# EasyEDA schematic SCH_AiOV4MicroCAN_2025-06-21.json
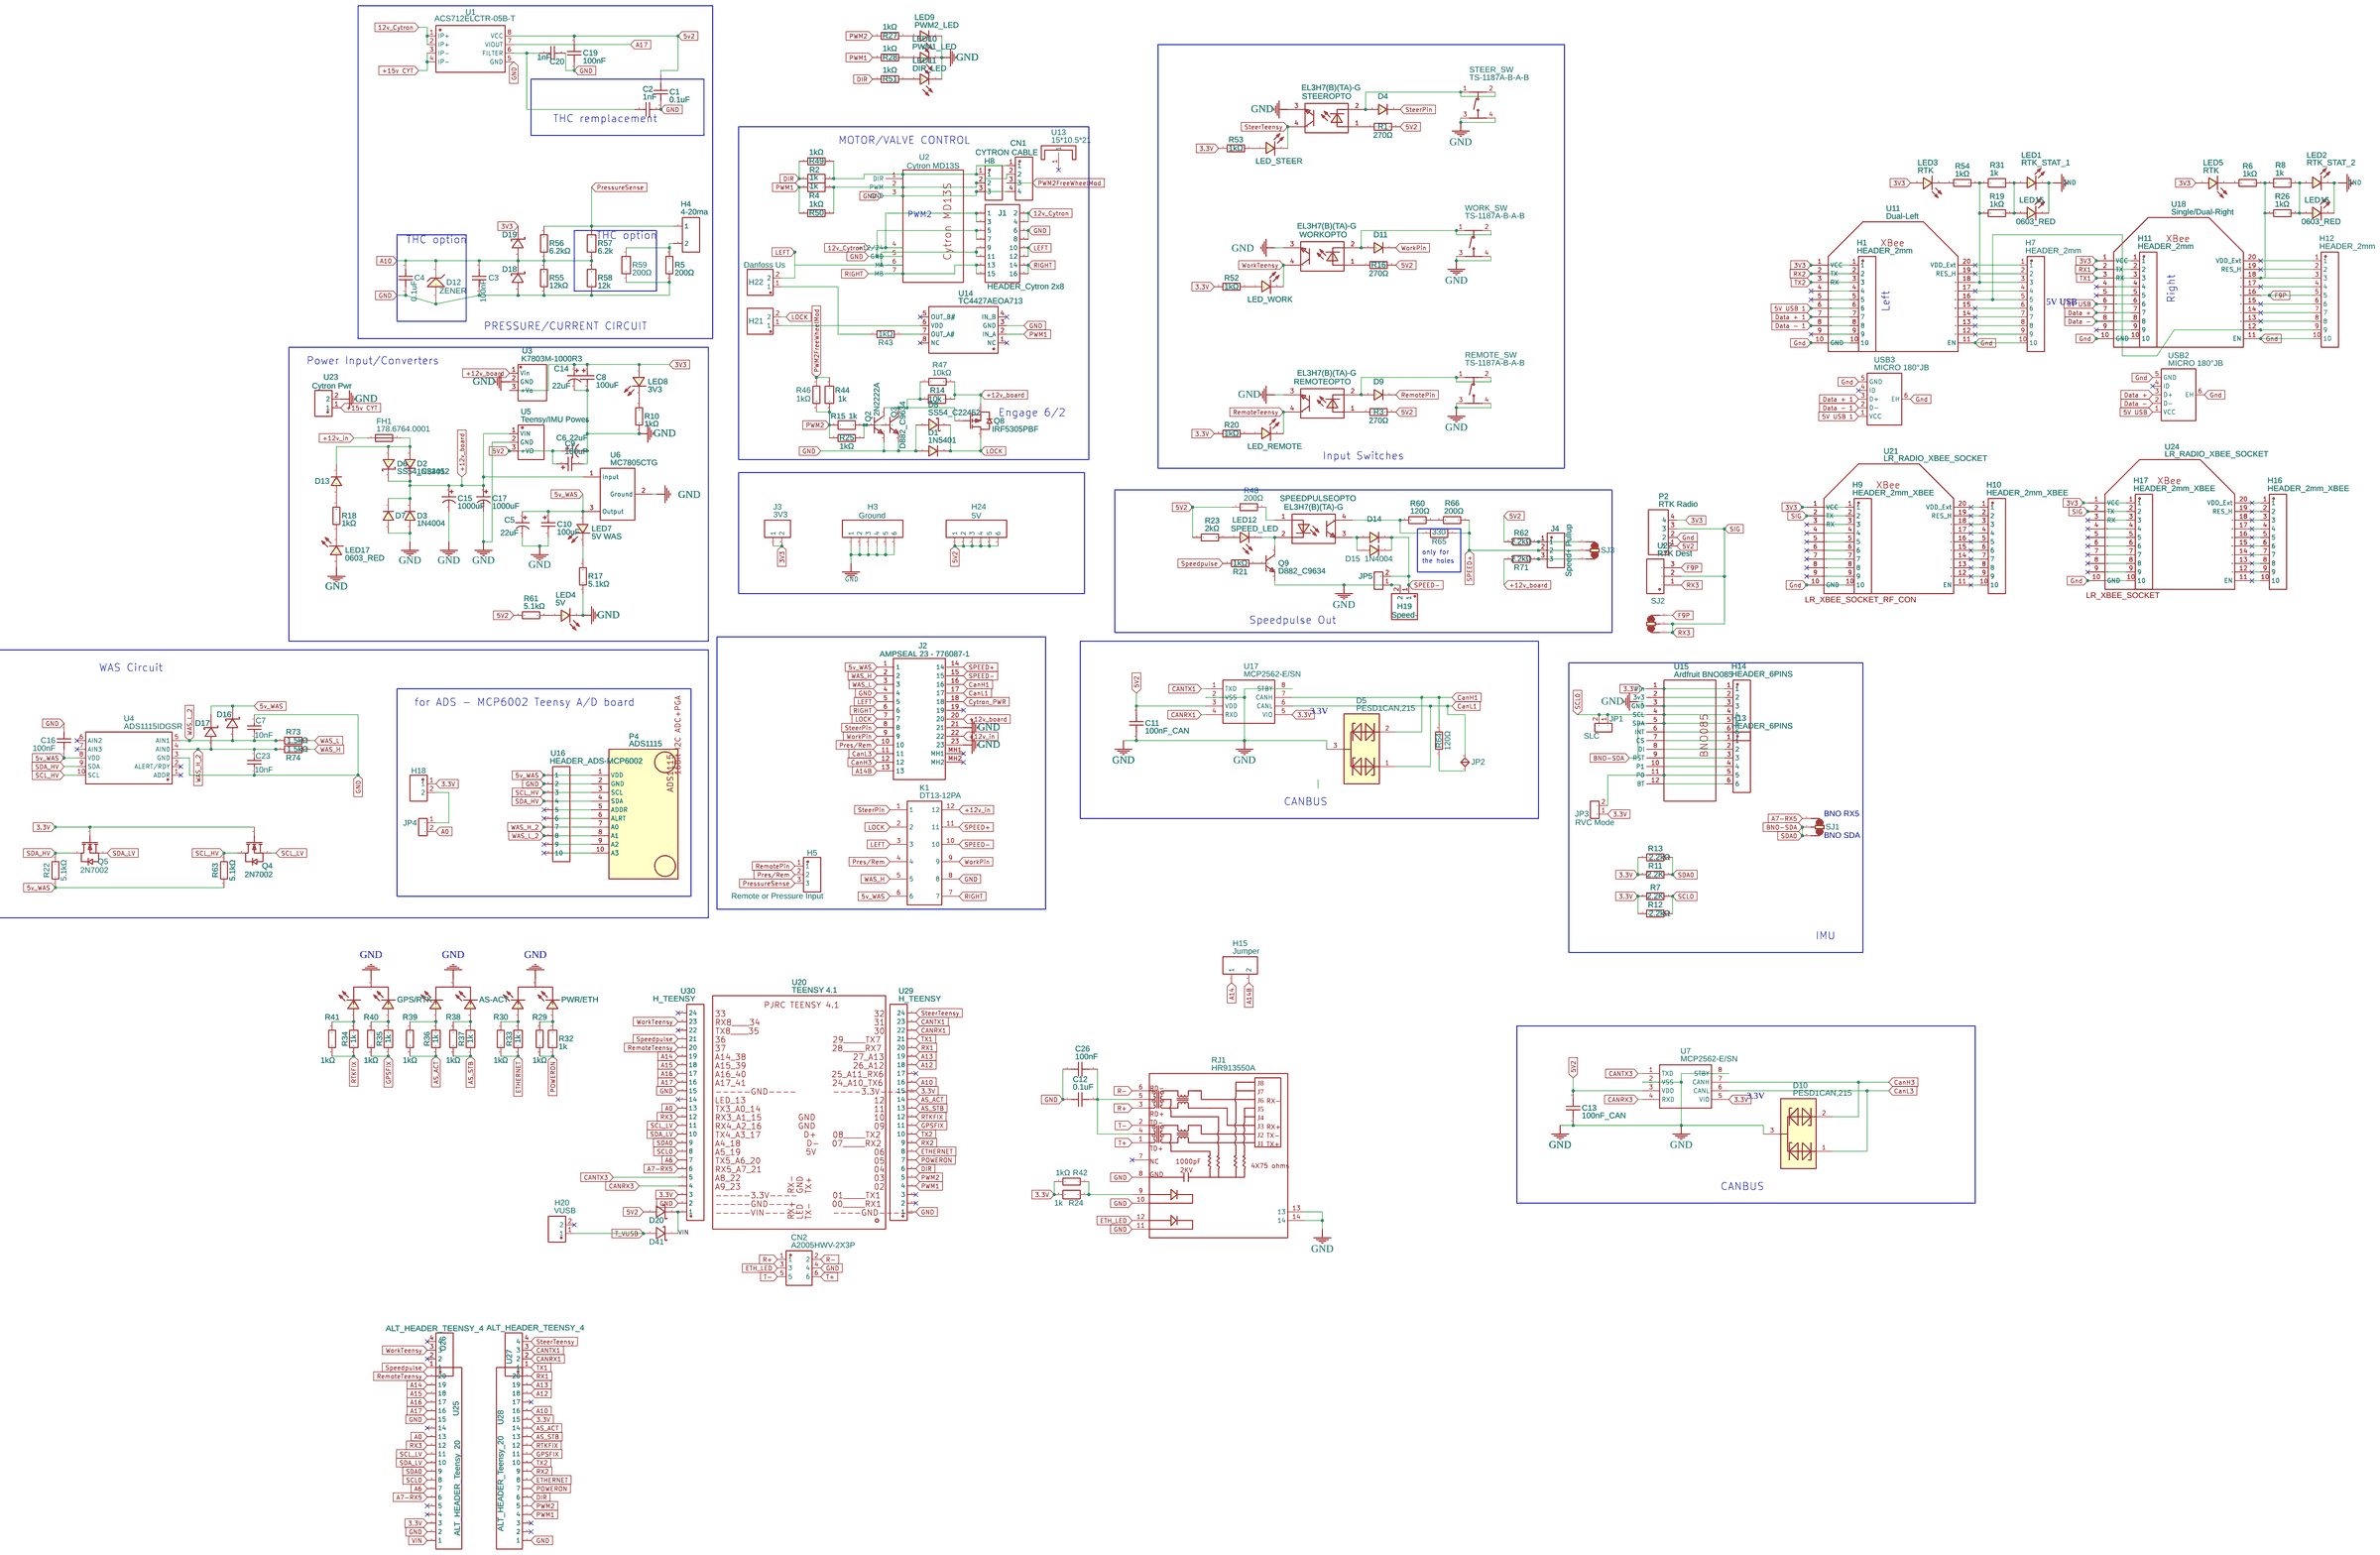
[diagram p0: schematic sheet]

## Parts
AS-ACT  DY-339URUYGW/SN  [LED-TH_3P-BD5.0-P2.54]
C1  0.1uF  [CAP-TH_L3.8-W2.5-P2.50-D0.51]
C2  1nF  [CAP-TH_L6.0-W5.0-P5.00-D1.0]
C3  100nF  [C0603]
C4  0.1uF  [CAP-TH_L3.8-W2.5-P2.50-D0.51]
C5  22uF  [CAP-TH_BD4.0-P1.50-D0.8-FD]
C6  22uF  [CAP-TH_BD4.0-P1.50-D0.8-FD]
C7  10nF  [C0805]
C8  100uF  [CASE-B_3528]
C9  100uF  [CASE-B_3528]
C10  100uF  [CASE-B_3528]
C11  100nF_CAN  [C0603]
C12  0.1uF  [CAP-TH_L3.8-W2.5-P2.50-D0.51]
C13  100nF_CAN  [C0603]
C14  22uF  [CAP-TH_BD4.0-P1.50-D0.8-FD]
C15  1000uF  [CAP-TH_BD13.0-P5.00-D1.2-FD]
C16  100nF  [C0603]
C17  1000uF  [CAP-TH_BD13.0-P5.00-D1.2-FD]
C19  100nF  [C0603]
C20  1nF  [C0603]
C23  10nF  [C0805]
C26  100nF  [C0603]
CN1  CYTRON CABLE  [CONN-TH_SEEED-110990030]
CN2  A2005HWV-2X3P  [HDR-TH_6P-P2.00-V-F-R2-C3-S2.00]
D1  1N5401  [DO-201_BD5.3-L9.5-P13.50-D1.4-RD]
D2  1N5401  [DO-201_BD5.3-L9.5-P13.50-D1.4-RD]
D3  1N4004  [DO-41_BD2.4-L4.7-P8.70-D0.9-FD]
D4  SM4007PL  [SOD-123F_L2.8-W1.8-LS3.7-RD]
D5  PESD1CAN,215  [SOT-23_L2.9-W1.3-P1.90-LS2.4-BR]
D6  SS54_C22452  [SMA_L4.4-W2.8-LS5.4-R-RD]
D7  SM4007PL  [SOD-123F_L2.8-W1.8-LS3.7-RD]
D8  SS54_C22452  [SMA_L4.4-W2.8-LS5.4-R-RD]
D9  SM4007PL  [SOD-123F_L2.8-W1.8-LS3.7-RD]
D10  PESD1CAN,215  [SOT-23_L2.9-W1.3-P1.90-LS2.4-BR]
D11  SM4007PL  [SOD-123F_L2.8-W1.8-LS3.7-RD]
D12  ZENER  [ZENER]
D13  SM4007PL  [SOD-123F_L2.8-W1.8-LS3.7-RD]
D14  SM4007PL  [SOD-123F_L2.8-W1.8-LS3.7-RD]
D15  1N4004  [DO-41_BD2.4-L4.7-P8.70-D0.9-FD]
D16  1N5819WS  [SOD-323_L1.8-W1.3-LS2.5-RD]
D17  1N5819WS  [SOD-323_L1.8-W1.3-LS2.5-RD]
D18  1N5819WS  [SOD-323_L1.8-W1.3-LS2.5-RD]
D19  1N5819WS  [SOD-323_L1.8-W1.3-LS2.5-RD]
D20  1N5819WS  [SOD-323_L1.8-W1.3-LS2.5-RD COPY - NO SILK]
D41  1N5819WS  [SOD-323_L1.8-W1.3-LS2.5-RD COPY - NO SILK]
FH1  178.6764.0001  [178.6764.0001]
GPS/RTK  DY-339URUYGW/SN  [LED-TH_3P-BD5.0-P2.54]
H1  HEADER_2mm  [HDR-TH_10P-P2.00-V-F]
H3  Ground  [HDR-TH_6P-P2.54-V-M-1]
H4  4-20ma  [HDR-TH_2P-P2.54-V-M-1]
H5  Remote or Pressure Input  [HDR-TH_3P-P2.54-V-M]
H7  HEADER_2mm  [HDR-TH_10P-P2.00-V-F]
H8  HEADER_3PINS  [HDR-TH_3P-P2.54-V-F]
H9  HEADER_2mm_XBEE  [HDR-TH_10P-P2.00-V-F]
H10  HEADER_2mm_XBEE  [HDR-TH_10P-P2.00-V-F]
H11  HEADER_2mm  [HDR-TH_10P-P2.00-V-F]
H12  HEADER_2mm  [HDR-TH_10P-P2.00-V-F]
H13  HEADER_6PINS  [HDR-TH_6P-P2.54-V-F]
H14  HEADER_6PINS  [HDR-TH_6P-P2.54-V-F]
H15  Jumper  [HDR-TH_2P-P2.54-V-M-1]
H16  HEADER_2mm_XBEE  [HDR-TH_10P-P2.00-V-F]
H17  HEADER_2mm_XBEE  [HDR-TH_10P-P2.00-V-F]
H18  22850102ANG1SYA02  [HDR-TH_2P-P2.54-V-F]
H19  Speed-  [HDR-TH_2P-P2.54-V-M-1]
H20  VUSB  [HDR-TH_2P-P2.54-V-F]
H21  68000-102HLF  [HDR-TH_2P-P2.54-V-M-1]
H22  Danfoss Us  [HDR-TH_2P-P2.54-V-M-1]
H24  5V  [HDR-TH_6P-P2.54-V-M-1]
J1  HEADER_Cytron 2x8  [HDR-TH_16P-P2.54-V-F-R2-C8-S2.54-1]
J2  AMPSEAL 23 - 776087-1  [7760871-EXT]
J3  3V3  [HDR-M-2.54_1X2]
J4  Speed+ Pullup  [HDR-TH_3P-P2.54-V-M]
JP1  SLC  [S_JUMPER_2]
JP2  SPARKFUN-JUMPERS_JUMPER-SMT_2_NC_PASTE_NO-SILK  [SPARKFUN-JUMPERS_SMT-JUMPER_2_NC_PASTE_NO-SILK]
JP3  RVC Mode  [S_JUMPER_2]
JP4  A0  [S_JUMPER_2]
JP5  RVC Mode  [S_JUMPER_2]
K1  DT13-12PA  [DT13-12PA]
LED1  RTK_STAT_1  [LED-TH_BD3.8-P2.54-FD]
LED2  RTK_STAT_2  [LED-TH_BD3.8-P2.54-FD]
LED3  RTK  [LED0805-R-RD]
LED4  5V  [LED0805-R-RD]
LED5  RTK  [LED0805-R-RD]
LED7  5V WAS  [LED0805-R-RD]
LED8  3V3  [LED0805-R-RD]
LED9  PWM2_LED  [LED0603-RD]
LED10  PWM1_LED  [LED0603-RD]
LED11  DIR_LED  [LED0603-RD]
LED12  SPEED_LED  [LED0603-RD]
LED15  0603_RED  [LED0603-RD]
LED16  0603_RED  [LED0603-RD]
LED17  0603_RED  [LED0603-RD]
LED_REMOTE  Remote  [LED0603-R-RD_WHITE]
LED_STEER  Steer  [LED0603-R-RD_WHITE]
LED_WORK  Work  [LED0603-R-RD_WHITE]
P2  RTK Radio  [CONN-TH_4P-P2.54_KF2510-4A]
P4  ADS1115  [ADS1115 BREAKOUT BOARD]
PWR/ETH  DY-339URUYGW/SN  [LED-TH_3P-BD5.0-P2.54]
Q2  2N2222A  [TO-92-3_L4.8-W3.7-P2.54-R]
Q3  D882_C9634  [SOT-89-3_L4.5-W2.5-P1.50-LS4.2-BR]
Q4  2N7002  [SOT-23-3_L2.9-W1.3-P1.90-LS2.4-BR]
Q5  2N7002  [SOT-23-3_L2.9-W1.3-P1.90-LS2.4-BR]
Q8  IRF5305PBF  [TO-220-3_L10.0-W4.5-P2.54-T]
Q9  D882_C9634  [SOT-89-3_L4.5-W2.5-P1.50-LS4.2-BR]
R1  270Ω  [R0603]
R2  1k  [RES-TH_BD2.4-L6.3-P10.30-D0.6]
R3  270Ω  [R0603]
R4  1k  [RES-TH_BD2.4-L6.3-P10.30-D0.6]
R5  200Ω  [R0805]
R6  1kΩ  [R0603 COPY - NO SILK]
R7  2.2K  [RES-TH_BD2.2-L6.5-P10.50-D0.6]
R8  1k  [RES-TH_BD2.4-L6.3-P10.30-D0.6]
R10  1kΩ  [R0603 COPY - NO SILK]
R11  2.2K  [RES-TH_BD2.2-L6.5-P10.50-D0.6]
R12  2.2kΩ  [R0805]
R13  2.2kΩ  [R0805]
R14  10k  [RES-TH_BD2.4-L6.3-P10.30-D0.6]
R15  1k  [RES-TH_BD2.4-L6.3-P10.30-D0.6]
R16  270Ω  [R0603]
R17  5.1kΩ  [R0603]
R18  1kΩ  [R0603 COPY - NO SILK]
R19  1kΩ  [R0603 COPY - NO SILK]
R20  1kΩ  [R0603 COPY - NO SILK]
R21  1kΩ  [R0603 COPY - NO SILK]
R22  5.1kΩ  [R0603]
R23  2kΩ  [R0603 COPY - NO SILK]
R24  1k  [RES-TH_BD2.4-L6.3-P10.30-D0.6]
R25  1kΩ  [R0603 COPY - NO SILK]
R26  1kΩ  [R0603 COPY - NO SILK]
R27  1kΩ  [R0603 COPY - NO SILK]
R28  1kΩ  [R0603 COPY - NO SILK]
R29  1kΩ  [R0603 COPY - NO SILK]
R30  1kΩ  [R0603 COPY - NO SILK]
R31  1k  [RES-TH_BD2.4-L6.3-P10.30-D0.6]
R32  1k  [RES-TH_BD2.4-L6.3-P10.30-D0.6]
R33  1k  [RES-TH_BD2.4-L6.3-P10.30-D0.6]
R34  1k  [RES-TH_BD2.4-L6.3-P10.30-D0.6]
R35  1k  [RES-TH_BD2.4-L6.3-P10.30-D0.6]
R36  1k  [RES-TH_BD2.4-L6.3-P10.30-D0.6]
R37  1k  [RES-TH_BD2.4-L6.3-P10.30-D0.6]
R38  1kΩ  [R0603 COPY - NO SILK]
R39  1kΩ  [R0603 COPY - NO SILK]
R40  1kΩ  [R0603 COPY - NO SILK]
R41  1kΩ  [R0603 COPY - NO SILK]
R42  1kΩ  [R0603 COPY - NO SILK]
R43  1kΩ  [R1206]
R44  1k  [RES-TH_BD2.4-L6.3-P10.30-D0.6]
R46  1kΩ  [R0603 COPY - NO SILK]
R47  10kΩ  [R1206]
R48  200Ω  [R0805]
R49  1kΩ  [R0603 COPY - NO SILK]
R50  1kΩ  [R0603 COPY - NO SILK]
R51  1kΩ  [R0603 COPY - NO SILK]
R52  1kΩ  [R0603 COPY - NO SILK]
R53  1kΩ  [R0603 COPY - NO SILK]
R54  1kΩ  [R0603 COPY - NO SILK]
R55  12kΩ  [R0603 COPY - NO SILK]
R56  6.2kΩ  [R0603 COPY - NO SILK]
R57  6.2k  [RES-TH_BD2.4-L6.3-P10.30-D0.6]
R58  12k  [RES-TH_BD2.4-L6.3-P10.30-D0.6]
R59  200Ω  [RES-TH_BD2.4-L6.3-P10.30-D0.6]
R60  120Ω  [R0805]
R61  5.1kΩ  [R0603]
R62  2.2kΩ  [R0805]
R63  5.1kΩ  [R0603]
R64  120Ω  [R0805]
R65  330  [RES-TH_BD2.4-L6.3-P10.30-D0.6]
R66  200Ω  [R0805]
R71  2.2kΩ  [R0805]
R73  1.5kΩ  [R0603]
R74  1.5kΩ  [R0603]
REMOTE_SW  TS-1187A-B-A-B  [SW-SMD_4P-L5.1-W5.1-P3.70-LS6.5-TL-2]
REMOTEOPTO  EL3H7(B)(TA)-G  [SOP-4_L4.4-W2.8-P1.27-LS7.0-TL]
RJ1  HR913550A  [RJ45-TH_HR913550A]
SJ1  JUMPER-PAD-3-NO  [S_JUMPER_3]
SJ2  JUMPER-PAD-3-NO  [S_JUMPER_3]
SJ3  JUMPER-PAD-3-NO  [S_JUMPER_3]
SPEEDPULSEOPTO  EL3H7(B)(TA)-G  [SOP-4_L4.4-W2.8-P1.27-LS7.0-TL]
STEER_SW  TS-1187A-B-A-B  [SW-SMD_4P-L5.1-W5.1-P3.70-LS6.5-TL-2]
STEEROPTO  EL3H7(B)(TA)-G  [SOP-4_L4.4-W2.8-P1.27-LS7.0-TL]
U1  ACS712ELCTR-05B-T  [SOIC-8_L5.0-W4.0-P1.27-LS6.0-BL]
U2  Cytron MD13S  [CYTRON MD13S]
U3  K7803M-1000R3  [PWRM-TH_K78XXM-1000R3]
U4  ADS1115IDGSR  [MSOP-10_L3.0-W3.0-P0.50-LS5.0-BL]
U5  Teensy/IMU Power  [PWRM-TH_K7805M-1000R3]
U6  MC7805CTG  [TO-220-3_L10.0-W4.5-P2.54-T]
U7  MCP2562-E/SN  [SOIC-8_L5.0-W4.0-P1.27-LS6.0-BL]
U11  Dual-Left  [SIMPLERTK2B_MICRO_SMA (2)]
U13  15*10.5*21  [SINK-TH_L15.0-W10.5-H21.0]
U14  TC4427AEOA713  [SOIC-8_L4.9-W3.9-P1.27-LS6.0-BL]
U15  Ardfruit BNO085  [ADAFRUIT-BNO085]
U16  HEADER_ADS-MCP6002  [HDR-F-2.54_1X10]
U17  MCP2562-E/SN  [SOIC-8_L5.0-W4.0-P1.27-LS6.0-BL]
U18  Single/Dual-Right  [SIMPLERTK2B_MICRO_SMA (2)]
U20  TEENSY 4.1  [TEENSY-4.1-NO-PADS AIO V4]
U21  LR_RADIO_XBEE_SOCKET  [LR_XBEE_SOCKET_RF_CON]
U22  RTK Dest  [HDR-TH_3P-P2.54-V-M-1]
U23  Cytron Pwr  [CONN-TH_2P-P5.08_JL500-50802G01]
U24  LR_RADIO_XBEE_SOCKET  [LR_XBEE_SOCKET]
U25  ALT_HEADER_Teensy_20  [HDR-TH_20P-P2.54-V-F_1.02MM]
U26  ALT_HEADER_TEENSY_4  [HDR-TH_4P-P2.54-V-F]
U27  ALT_HEADER_TEENSY_4  [HDR-TH_4P-P2.54-V-F]
U28  ALT_HEADER_Teensy_20  [HDR-TH_20P-P2.54-V-F_1.02MM]
U29  H_TEENSY  [HDR-TH_24P-P2.54-V-F]
U30  H_TEENSY  [HDR-TH_24P-P2.54-V-F]
USB2  MICRO 180°JB  [MINI-USB-SMD_U255-051N-4BH70-XS]
USB3  MICRO 180°JB  [MINI-USB-SMD_U255-051N-4BH70-XS]
WORK_SW  TS-1187A-B-A-B  [SW-SMD_4P-L5.1-W5.1-P3.70-LS6.5-TL-2]
WORKOPTO  EL3H7(B)(TA)-G  [SOP-4_L4.4-W2.8-P1.27-LS7.0-TL]

## Library data of the parts
AS-ACT GPS/RTK PWR/ETH = DY-339URUYGW/SN: Supplier: LCSC; Supplier Part: C459134; Manufacturer: TONYU; Contributor: LCSC; JLCPCB Part Class: Extended Part
C1 C4 C12 = SR155C103KAR: Supplier: LCSC; Supplier Part: C444736; Manufacturer: AVX; Contributor: LCSC; LCSC Assembly: Yes; SMT Type: Extend
C2 = CK45-B3AD102KYNNA: Supplier: LCSC; Manufacturer: TDK; Supplier Part: C97720; JLCPCB Part Class: Extended Part
C3 C11 C13 C16 C19 C26 = CC0603KRX7R9BB104: Supplier: LCSC; Manufacturer: YAGEO; Supplier Part: C14663; JLCPCB Part Class: Basic Part
C5 C6 = 22uF 16V 4*7: Supplier: LCSC; Manufacturer: ValuePro; Supplier Part: C43845; JLCPCB Part Class: Extended Part
C7 C23 = CL21B103KBANNNC: Supplier: LCSC; Manufacturer: SAMSUNG; Supplier Part: C1710; JLCPCB Part Class: Basic Part
C8-C10 = TAJB107K006RNJ: Supplier: LCSC; Manufacturer: Kyocera AVX; Supplier Part: C16133; JLCPCB Part Class: Basic Part
C14 = 22uF 16V 4*5: Supplier: LCSC; Manufacturer: ValuePro; Supplier Part: C43800; JLCPCB Part Class: Extended Part
C15 C17 = 35YXJ1000M12.5X20: Supplier: LCSC; Manufacturer: rubycon(红宝石); Supplier Part: C88743; JLCPCB Part Class: Extended Part
C20 = CL10B102KB8NNNC: Supplier: LCSC; Manufacturer: SAMSUNG; Supplier Part: C1588; JLCPCB Part Class: Basic Part
CN1 = SEEED-110990030: Supplier: LCSC; Supplier Part: C403774; Manufacturer: Seeed(矽递科技); Contributor: LCSC; JLCPCB Part Class: Extended Part
CN2 = A2005HWV-2X3P: Supplier: LCSC; Supplier Part: C2906071; Contributor: LCSC; JLCPCB Part Class: Extended Part
D1 D2 = 1N5401: Supplier: LCSC; Manufacturer: MDD; image: //image.lceda.cn/szlcsc/C2459.jpg; Supplier Part: C2459; LCSC Assembly: Yes; SMT Type: Extend
D3 D15 = 1N4004: Supplier: LCSC; Manufacturer: MDD; image: //image.lceda.cn/szlcsc/C3058.jpg; Supplier Part: C3058; LCSC Assembly: Yes; SMT Type: Extend
D4 D7 D9 D11 D13 D14 = SM4007PL: Supplier: LCSC; Manufacturer: MDD; Supplier Part: C64898; JLCPCB Part Class: Basic Part; link: https://lcsc.com/eda_search?q=C64898&%26type=1&ref=editor
D5 D10 = PESD1CAN,215: Supplier: LCSC; Manufacturer: Nexperia; image: //image.lceda.cn/szlcsc/C15771.jpg; Supplier Part: C15771; SMT Type: Extend; JLCPCB SMD: Yes; Paste Type: expand
D6 D8 = SS54_C22452: Supplier: LCSC; Manufacturer Part: SS54; Manufacturer: MDD; Supplier Part: C22452; JLCPCB Part Class: Basic Part
D12 = ZENER: Zener Diode
D16-D20 D41 = 1N5819WS: Contributor: LCSC; Supplier: LCSC; Supplier Part: C191023; Manufacturer: Hottech(合科泰); JLCPCB Part Class: Basic Part; link: https://lcsc.com/eda_search?q=C191023&%26type=1&ref=editor
FH1 = 178.6764.0001: Supplier: LCSC; Supplier Part: C142933; Manufacturer: Littelfuse(美国力特); Contributor: LCSC; JLCPCB Part Class: Extended Part
H1 H7 H9-H12 H16 H17 = C691436: Supplier: LCSC; Manufacturer: BOOMELE(Boom Precision Elec); Contributor: LCSC; JLCPCB Part Class: Extended Part
H3 H24 = Header-Male-2.54_1x6: Supplier: LCSC; Manufacturer: BOOMELE; Supplier Part: C37208; JLCPCB Part Class: Extended Part
H4 H15 = Header-Male-2.54_1x2: Supplier: LCSC; Supplier Part: C2905434; JLCPCB Part Class: Extended Part
H5 J4 = PZ254V-11-03P_C2937625: Contributor: LCSC; Supplier: LCSC; Supplier Part: C2937625; Manufacturer: XFCN(兴飞); Manufacturer Part: PZ254V-11-03P; JLCPCB Part Class: Extended Part; link: https://lcsc.com/eda_search?q=C2937625&%26type=1&ref=editor
H8 = FFH25405-S03S1001K6K: Supplier: LCSC; Supplier Part: C146243; Contributor: LCSC; JLCPCB Part Class: Extended Part
H13 H14 = PM254-1-06-Z-8.5: Supplier: LCSC; Supplier Part: C2897369; Manufacturer: HCTL(华灿天禄); Contributor: LCSC; JLCPCB Part Class: Extended Part
H18 = 22850102ANG1SYA02: Supplier: LCSC; Supplier Part: C429966; Manufacturer: JILN(锦凌); Contributor: LCSC; JLCPCB Part Class: Extended Part
H19 H21 H22 = 68000-102HLF: Supplier: LCSC; Supplier Part: C2905434; Contributor: LCSC; JLCPCB Part Class: Extended Part
H20 = ZX-PM2.54-1-2PY: Supplier: LCSC; Supplier Part: C7499322; Manufacturer: Megastar(兆星); Contributor: lcsc; JLCPCB Part Class: Extended Part
J1 = Header-Female-2.54_2x8: Supplier: LCSC; Manufacturer: BOOMELE(博穆精密); Manufacturer Part: 2.54-2*8P母; Supplier Part: C30734; JLCPCB Part Class: Extended Part
J2 = AMPSEAL 23 - 776087-1: Contributor: aKKoufen; Link: https://fr.rs-online.com/web/p/embases-circuits-imprimes/7181471; Code RS: 718-1471; Ref Fabricant: 776087-1; Marque: TE Connectivity; Supplier Part: C378893
J3 = HDR-M-2.54_1x2: Supplier Part: C124375; Supplier: LCSC; Contributor: LCEDA_Lib
JP1 JP3-JP5 = (JONGJIN)JUMPER_PAD_2P: Jumper 2 Pin; Contributor: PatternAgents
JP2 = SPARKFUN-JUMPERS_JUMPER-SMT_2_NC_PASTE_NO-SILK: Contributor: raskol; Supplier: opencircuit
K1 = DT13-12PA: Manufacturer: DEUTSCH DT; link: https://www.te.com/usa-en/product-DT13-12PA.html?fbclid=IwAR39tNBAoYJf2IA76Wg8xnUmEBiRwHUhbK_2fx16O6vP97envFwLxjVRyOc; Contributor: razzer_n
LED1 LED2 = LEDOrange orange 3AO4UD: Supplier: LCSC; Manufacturer: KENTO; image: //image.lceda.cn/szlcsc/C62095.jpg; Supplier Part: C62095
LED3-LED5 LED7 LED8 = 0805G (Green): Supplier: LCSC; Manufacturer: KENTO; Manufacturer Part: KT-0805翠绿; Supplier Part: C2297; JLCPCB Part Class: Basic Part
LED9-LED12 = 19-213/Y2C-CQ2R2L/3T(CY): Supplier: LCSC; Manufacturer: EVERLIGHT(亿光); Supplier Part: C72038; JLCPCB Part Class: Basic Part
LED15-LED17 = KT-0603R-RED: Supplier: LCSC; Manufacturer: null; Manufacturer Part: KT-0603R; Supplier Part: C2286; JLCPCB Part Class: Basic Part
LED_REMOTE LED_STEER LED_WORK = 0603WHITE LIGHT_C2290-WHITE: Supplier: LCSC; Manufacturer: null; Manufacturer Part: KT-0603白灯; Supplier Part: C2290; JLCPCB Part Class: Basic Part
P2 = KF2510-4A: Supplier Part: C27542; Supplier: LCSC; Manufacturer: ReliaPro; JLCPCB Part Class: Extended Part
P4 = ADS1115: sourceId: 1T5FDZYC8; Package Display: No
Q2 = 2N2222A: Supplier: LCSC; Supplier Part: C358533; Manufacturer: Foshan Blue Rocket Elec; Contributor: LCSC; Paste Type: expand
Q3 Q9 = D882_C9634: Supplier: LCSC; Manufacturer: CJ(江苏长电/长晶); Manufacturer Part: D882 Y档160~320; Supplier Part: C9634; JLCPCB Part Class: Basic Part; link: https://lcsc.com/eda_search?q=C9634&%26type=1&ref=editor
Q4 Q5 = 2N7002: Supplier: LCSC; Manufacturer: CJ; Supplier Part: C8545; JLCPCB Part Class: Basic Part
Q8 = IRF5305PBF: Supplier: LCSC; Manufacturer: Infineon(英飞凌); Supplier Part: C2623; JLCPCB Part Class: Extended Part
R1 R3 R16 = 0603WAF2700T5E: Supplier: LCSC; Manufacturer: UNI-ROYAL(厚声); Supplier Part: C22966; Resistance (Ohms): 270; JLCPCB Part Class: Basic Part
R2 R4 R15 R44 R57 R65 = RD 1/2WS 1K J T/B A1: Supplier: LCSC; Manufacturer: TyoHM; Contributor: LCSC
R5 R48 R66 = 0805W8F2000T5E: Supplier: LCSC; Manufacturer: UNI-ROYAL(厚声); Supplier Part: C17540; Resistance (Ohms): 200; JLCPCB Part Class: Basic Part
R6 R10 R18-R21 R25-R30 R38-R42 R46 R49-R54 = 0603WAF1001T5E: Supplier: LCSC; Manufacturer: UNI-ROYAL(厚声); Supplier Part: C21190; JLCPCB Part Class: Basic Part; link: https://lcsc.com/eda_search?q=C21190&%26type=1&ref=editor
R7 R11 = MFR0W4F2201A50: Supplier: LCSC; Manufacturer: UniOhm; Supplier Part: C58595; JLCPCB Part Class: Extended Part; Resistance: 2.2kΩ
R8 R14 R24 R31-R37 = RD 1/2WS 1K J T/B A1: Supplier: LCSC; Supplier Part: C433798; Manufacturer: TyoHM; Contributor: LCSC
R12 R13 R62 R71 = 0805W8F2201T5E: Supplier: LCSC; Manufacturer: UniOhm; Supplier Part: C17520; Resistance (Ohms): 2.2K; JLCPCB Part Class: Basic Part
R17 R22 R61 R63 = 0603WAF5101T5E: Supplier: LCSC; Manufacturer: UniOhm; Supplier Part: C23186; Resistance (Ohms): 5.1K; JLCPCB Part Class: Basic Part
R23 = 0603WAF2001T5E: Supplier: LCSC; Manufacturer: UNI-ROYAL(厚声); Supplier Part: C22975; JLCPCB Part Class: Basic Part; link: https://lcsc.com/eda_search?q=C22975&%26type=1&ref=editor
R43 = 1206W4F1001T5E: Supplier: LCSC; Manufacturer: UNI-ROYAL(厚声); Supplier Part: C4410; JLCPCB Part Class: Basic Part
R47 = 1206W4F1002T5E: Supplier: LCSC; Manufacturer: UniOhm; Supplier Part: C17902; Resistance (Ohms): 10K; JLCPCB Part Class: Basic Part
R55 = 0603WAF1202T5E: Supplier: LCSC; Manufacturer: UNI-ROYAL(厚声); Supplier Part: C22790; JLCPCB Part Class: Basic Part; link: https://lcsc.com/eda_search?q=C22790&%26type=1&ref=editor
R56 = 0603WAF6201T5E: Supplier: LCSC; Manufacturer: UNI-ROYAL(厚声); Supplier Part: C4260; JLCPCB Part Class: Basic Part; link: https://lcsc.com/eda_search?q=C4260&%26type=1&ref=editor
R58 R59 = RD 1/2WS 1K J T/B A1: Supplier: LCSC; Contributor: LCSC
R60 R64 = 0805W8F1200T5E: Supplier: LCSC; Manufacturer: UniOhm; Supplier Part: C17437; Resistance (Ohms): 120; JLCPCB Part Class: Basic Part
R73 R74 = 0603WAF1501T5E: Supplier: LCSC; Manufacturer: UniOhm; Supplier Part: C22843; Resistance (Ohms): 1.5K; JLCPCB Part Class: Basic Part
REMOTE_SW STEER_SW WORK_SW = TS-1187A-B-A-B: Contributor: LCSC; Supplier: LCSC; Supplier Part: C318884; Manufacturer: XKB Connectivity(中国星坤); JLCPCB Part Class: Basic Part
REMOTEOPTO SPEEDPULSEOPTO STEEROPTO WORKOPTO = EL3H7(B)(TA)-G: Supplier: LCSC; Manufacturer: EVERLIGHT(亿光); Supplier Part: C32565; JLCPCB Part Class: Basic Part
RJ1 = HR913550A: Supplier: LCSC; Manufacturer: HANRUN; Contributor: LCSC; Supplier Part: C163507; JLCPCB Part Class: Extended Part
SJ1-SJ3 = JUMPER-PAD-3-NO: Contributor: Matt Elias
U1 = ACS712ELCTR-05B-T: Supplier: LCSC; Manufacturer: ALLEGRO(美国埃戈罗); Supplier Part: C44471; JLCPCB Part Class: Extended Part
U2 = Cytron MD13S: Contributor: THume
U3 = K7803M-1000R3: Supplier: LCSC; Manufacturer: MORNSUN(金升阳); Contributor: LCSC; Supplier Part: C132363; JLCPCB Part Class: Extended Part
U4 = ADS1115IDGSR: Supplier: LCSC; Manufacturer: TI; Supplier Part: C37593; JLCPCB Part Class: Extended Part
U5 = K7805M-1000R3: Supplier: LCSC; Manufacturer: MORNSUN; Contributor: LCSC; Supplier Part: C132362; JLCPCB Part Class: Extended Part
U6 = MC7805CTG: Supplier: LCSC; Manufacturer: ON; Supplier Part: C22456; JLCPCB Part Class: Extended Part; Package Display: No
U7 U17 = MCP2562-E/SN: Supplier: LCSC; Manufacturer: MICROCHIP; Supplier Part: C53609; JLCPCB Part Class: Extended Part
U11 U18 = SIMPLERTK2B_MICRO_SMA: Supplier: Ardusimple; Contributor: jhandel
U13 = 15*10.5*21: Supplier: LCSC; Supplier Part: C4649; Manufacturer: Made in China; Contributor: LCSC; JLCPCB Part Class: Extended Part
U14 = TC4427AEOA713: Supplier: LCSC; Manufacturer: MICROCHIP(美国微芯); Contributor: LCSC; Supplier Part: C20551; JLCPCB Part Class: Extended Part
U15 = Ardfruit BNO085: Manufacturer: Ardfruit; Contributor: THume
U16 = HDR-F-2.54_1x10: Supplier Part: C2897373; Supplier: LCSC; Contributor: LCEDA_Lib
U20 = TEENSY 4.1: Manufacturer: PJRC; Manufacturer Part: TEENSY41; Supplier: PJRC; Supplier Part: TEENSY41; link: https://www.pjrc.com/store/teensy41.html; Contributor: wildbuckwheat
U21 U24 = 3GBEE _SOCKET_XBEE: Package Display: Yes
U22 = 826629-3: Supplier: LCSC; Supplier Part: C49257; Contributor: LCSC; JLCPCB Part Class: Extended Part; Package Display: No
U23 = JL500-50802G01: Supplier: LCSC; Supplier Part: C387820; Manufacturer: JILN; Contributor: LCSC; JLCPCB Part Class: Extended Part
U25 U28 = Header-Female-2.54_1x20: Supplier: LCSC; Manufacturer: BOOMELE; Manufacturer Part: 2.54mm 1*20P Female header; Supplier Part: C50984; JLCPCB Part Class: Extended Part
U26 U27 = FH-00133: Supplier: LCSC; Supplier Part: C2685089; Manufacturer: Liansheng(连盛); Contributor: LCSC; JLCPCB Part Class: Extended Part
U29 U30 = X6511FV-24-C85D32 with numbers: Contributor: Matt Elias; Supplier: LCSC; Supplier Part: C2883741; Manufacturer: XKB Connectivity(中国星坤); Manufacturer Part: X6511FV-24-C85D32; JLCPCB Part Class: Extended Part
USB2 USB3 = MICRO 180°JB: Contributor: LCSC; Supplier: LCSC; Supplier Part: C456007; Manufacturer: SHOU HAN(首韩); JLCPCB Part Class: Extended Part

## Nets
3.3V: H14.1 H18.1 JP3.1 Q4.1(G) Q5.1(G) R7.2 R11.2 R12.1 R13.1 R20.2 R24.2 R42.2 R52.2 R53.2 U7.5(VIO) U15.1(Vin) U17.5(VIO) U25.3 U28.15 U29.15 U30.3
3V3: C8.1 C14.1 D19.1(K) H1.1 H9.1 H11.1 H17.1 J3.1 J3.2 LED3.1(A) LED5.1(A) LED8.1(A) P2.4 U3.3(+Vo) U11.1(VCC) U18.1(VCC) U21.1(VCC) U24.1(VCC)
5V2: C6.1 C9.1 C11.2 C13.2 D20.2(A) H24.1 H24.2 H24.3 H24.4 H24.5 H24.6 P2.1 R1.2 R3.2 R16.2 R23.1 R48.1 R61.2 R62.1 U5.3(+VO) U7.3(VDD) U17.3(VDD)
5v2: C1.1 C19.2 U1.8(VCC)
5V USB: H11.6 U18.6(PWM0RSSI) USB2.1(VCC)
5V USB 1: H1.6 U11.6(PWM0RSSI) USB3.1(VCC)
5v_WAS: C5.1 C10.1 C16.1 D16.1(K) D17.1(K) J2.1 K1.6 LED7.1(A) P4.1(VDD) R22.1 R63.1 U4.8(VDD) U6.3(Output) U16.1
12v_Cytron: J1.1 J1.2 J1.3 J1.4 U1.1(IP+) U1.2(IP+) U2.4(+12/24)
+12v_board: C15.1 C17.1 D2.1(C) D3.2(K) D6.2(K) D7.1(C) J2.20 Q8.3(S) R14.2 R47.2 R71.1 U3.1(Vin) U5.1(VIN) U6.1(Input)
+12v_in: FH1.1 J2.22 K1.12
+15v CYT: U1.3(IP-) U1.4(IP-) U23.1
Gnd: H1.10 H7.10 H9.10 H11.10 H12.10 H17.10 P2.2 U11.10(GND) U11.11(EN) U18.10(GND) U18.11(EN) U21.10(GND) U24.10(GND) USB2.5(GND) USB2.6(EH) USB3.5(GND) USB3.6(EH)
GND: AS-ACT.2(-) C1.2 C2.2 C3.1 C4.1 C5.2 C6.2 C7.2 C8.2 C9.2 C10.2 C11.1 C12.1 C13.1 C14.2 C15.2 C16.2 C17.2 C19.1 C20.2 C23.1 C26.1 CN1.4 CN2.4 D1.2(A) D3.1(A) D5.3 D7.2(A) D8.1(A) D10.3 D12.1(A) D18.2(A) GPS/RTK.2(-) H3.1 H3.2 H3.3 H3.4 H3.5 H3.6 H8.3 H14.3 H19.2 J1.5 J1.6 J1.7 J1.8 J2.4 J2.21 J2.23 JP5.1 K1.8 LED1.2(K) LED2.2(K) LED4.2(K) LED9.1(C) LED10.1(C) LED11.1(C) LED15.1(K) LED16.1(K) LED17.2(A) P4.2(GND) PWR/ETH.2(-) Q2.3(E) Q3.3(E) Q9.3(E) R5.1 R10.1 R17.1 R55.1 R58.1 R59.1 REMOTE_SW.3(C) REMOTE_SW.4(D) REMOTEOPTO.3(EM) RJ1.8(GND) RJ1.10 RJ1.11 RJ1.13 RJ1.14 STEER_SW.3(C) STEER_SW.4(D) STEEROPTO.3(EM) U1.5(GND) U2.3(GND) U2.5(GND) U3.2(GND) U4.3(GND) U5.2(GND) U6.2(Ground) U7.2(VSS) U7.8(STBY) U14.3(GND) U15.3(GND) U16.2 U17.2(VSS) U17.8(STBY) U23.2 U25.2 U25.15 U28.1 U29.1 U30.2 U30.15 WORK_SW.3(C) WORK_SW.4(D) WORKOPTO.3(EM)
VIN: D20.1(K) D41.1(K) U25.1 U30.1
A0: JP4.2 U25.13 U30.13
A6: U25.7 U30.7
A7-RX5: SJ1.1 U25.6 U30.6
A10: C3.2 C4.2 D12.2(K) D18.1(K) D19.2(A) R55.2 R56.1 R57.1 R58.2 U28.16 U29.16
A12: U28.18 U29.18
A13: U28.19 U29.19
A14: H15.1 U25.19 U30.19
A14B: H15.2 J2.13
A15: U25.18 U30.18
A16: U25.17 U30.17
A17: U1.7(VIOUT) U25.16 U30.16
AS_ACT: R36.1 R39.2 U28.14 U29.14
AS_STB: R37.1 R38.2 U28.13 U29.13
BNO-SDA: H14.5 R11.1 R13.2 SJ1.2 SJ1.3 U15.5(SDA) U25.9 U30.9
CanH1: D5.2 J2.16 R64.2 U17.7(CANH)
CanH3: D10.2 J2.12 U7.7(CANH)
CanL1: D5.1 J2.17 JP2.2 U17.6(CANL)
CanL3: D10.1 J2.11 U7.6(CANL)
CANRX1: U17.4(RXD) U27.2 U29.22
CANRX3: U7.4(RXD) U30.4
CANTX1: U17.1(TXD) U27.3 U29.23
CANTX3: U7.1(TXD) U30.5
Cytron_PWR: J2.18
Data +: H11.7 U18.7(PWM1) USB2.3(D+)
Data + 1: H1.7 U11.7(PWM1) USB3.3(D+)
Data -: H11.8 U18.8(RESERVED) USB2.2(D-)
Data - 1: H1.8 U11.8(RESERVED) USB3.2(D-)
DIR: R2.1 R49.2 R51.2 U28.6 U29.6
ETH_LED: CN2.3 RJ1.12
ETHERNET: R30.2 R33.1 U28.8 U29.8
F9P: H12.5 SJ2.3 U18.16(RTSAD6DIO6) U22.3
GPSFIX: R35.1 R40.2 U28.11 U29.11
LEFT: H22.2 J1.9 J1.10 J1.11 J1.12 J2.5 K1.3 U2.6(MA)
LOCK: D1.1(C) D8.2(K) H21.2 J2.7 K1.2 Q8.2(D)
POWERON: R29.2 R32.1 U28.7 U29.7
Pres/Rem: H5.2 J2.10 K1.4
PressureSense: H4.1 H5.3 R56.2 R57.2
PWM1: R4.1 R28.2 R50.2 U14.2(IN A) U28.4 U29.4
PWM2: R15.1 R25.1 R27.2 R44.2 R46.2 U28.5 U29.5
PWM2FreeWheelMod: CN1.3 R44.1 R46.1
R+: CN2.1 RJ1.3
R-: CN2.2 RJ1.6
RemotePin: D9.1(C) H5.1
RemoteTeensy: LED_REMOTE.2(K) REMOTEOPTO.4(COL) U25.20 U30.20
RIGHT: J1.13 J1.14 J1.15 J1.16 J2.6 K1.7 U2.7(MB)
RTKFIX: R34.1 R41.2 U28.12 U29.12
RX1: H11.2 U18.2(TX) U28.20 U29.20
RX2: H1.2 U11.2(TX) U28.9 U29.9
RX3: H9.2 H17.2 P2.3 SJ2.1 SJ2.2 U21.2(TX) U22.1 U22.2 U24.2(TX) U25.12 U30.12
SCL0: H14.4 JP1.1 JP1.2 R7.1 R12.2 U15.4(SCL) U25.8 U30.8
SCL_HV: P4.3(SCL) Q4.3(D) R63.2 U4.10(SCL) U16.3
SCL_LV: Q4.2(S) U25.11 U30.11
SDA_HV: P4.4(SDA) Q5.3(D) R22.2 U4.9(SDA) U16.4
SDA_LV: Q5.2(S) U25.10 U30.10
SPEED+: J2.14 J4.2 K1.11 R65.2 R66.1 SJ3.2
SPEED-: D14.1(C) D15.2(K) H19.1 J2.15 JP5.2 K1.10
Speedpulse: R21.2 U26.1 U30.21
SteerPin: D4.1(C) J2.8 K1.1
SteerTeensy: LED_STEER.2(K) STEEROPTO.4(COL) U27.4 U29.24
T+: CN2.6 RJ1.1
T-: CN2.5 RJ1.2
T_VUSB: D41.2(A) H20.1
TX1: H11.3 U18.3(RX) U27.1 U29.21
TX2: H1.3 U11.3(RX) U28.10 U29.10
WAS_H: J2.2 K1.5 R74.2
WAS_H_2: C23.2 D17.2(A) P4.7(A0) R74.1 U4.4(AIN0) U16.7
WAS_L: J2.3 R73.2
WAS_L_2: C7.1 D16.2(A) P4.8(A1) R73.1 U4.5(AIN1) U16.8
WorkPin: D11.1(C) J2.9 K1.9
WorkTeensy: LED_WORK.2(K) U26.3 U30.23 WORKOPTO.4(COL)
Net-(AS-ACT-1): AS-ACT.1(+) R36.2 R39.1
Net-(AS-ACT-3): AS-ACT.3(+) R37.2 R38.1
Net-(C2-1): C2.1 C20.1 U1.6(FILTER)
Net-(C12-2): C12.2 C26.2 RJ1.4 RJ1.5
Net-(CN1-1): CN1.1 H8.1 R2.2 R49.1 U2.1(DIR)
Net-(CN1-2): CN1.2 H8.2 R4.2 R50.1 U2.2(PWM)
Net-(D2-2): D2.2(A) D6.1(A) D13.1(C) FH1.2
Net-(D4-2): D4.2(A) STEER_SW.1(A) STEER_SW.2(B) STEEROPTO.2(CAT)
Net-(D9-2): D9.2(A) REMOTE_SW.1(A) REMOTE_SW.2(B) REMOTEOPTO.2(CAT)
Net-(D11-2): D11.2(A) WORK_SW.1(A) WORK_SW.2(B) WORKOPTO.2(CAT)
Net-(D13-2): D13.2(A) R18.2
Net-(D14-2): D14.2(A) D15.1(A) SPEEDPULSEOPTO.3(EM)
Net-(GPS/RTK-1): GPS/RTK.1(+) R34.2 R41.1
Net-(GPS/RTK-3): GPS/RTK.3(+) R35.2 R40.1
Net-(H1-4): H1.4 U11.4(DO8)
Net-(H1-5): H1.5 U11.5(RESET)
Net-(H1-9): H1.9 U11.9(DTRDI8)
Net-(H4-2): H4.2 R5.2 R59.2
Net-(H7-1): H7.1 U11.20(VDD_Ext)
Net-(H7-2): H7.2 U11.19(RES_H)
Net-(H7-3): H7.3 R19.2 R31.2 R54.1 U11.18(AD2DIO2)
Net-(H7-4): H7.4 U11.17(AD3DIO3)
Net-(H7-5): H7.5 H12.9 U11.16(RTSAD6DIO6) U18.12(CTSDIO7)
Net-(H7-6): H7.6 U11.15(ASCAD5DIO5)
Net-(H7-7): H7.7 U11.14(VREF)
Net-(H7-8): H7.8 U11.13(ONSLEEP)
Net-(H7-9): H7.9 U11.12(CTSDIO7)
Net-(H9-3): H9.3 U21.3(RX)
Net-(H9-4): H9.4 U21.4(DO8)
Net-(H9-5): H9.5 U21.5(RESET)
Net-(H9-6): H9.6 U21.6(PWM0RSSI)
Net-(H9-7): H9.7 U21.7(PWM1)
Net-(H9-8): H9.8 U21.8(RESERVED)
Net-(H9-9): H9.9 U21.9(DTRDI8)
Net-(H10-1): H10.1 U21.20(VDD_Ext)
Net-(H10-2): H10.2 U21.19(RES_H)
Net-(H10-3): H10.3 U21.18(AD2DIO2)
Net-(H10-4): H10.4 U21.17(AD3DIO3)
Net-(H10-5): H10.5 U21.16(RTSAD6DIO6)
Net-(H10-6): H10.6 U21.15(ASCAD5DIO5)
Net-(H10-7): H10.7 U21.14(VREF)
Net-(H10-8): H10.8 U21.13(ONSLEEP)
Net-(H10-9): H10.9 U21.12(CTSDIO7)
Net-(H10-10): H10.10 U21.11(EN)
Net-(H11-4): H11.4 U18.4(DO8)
Net-(H11-5): H11.5 U18.5(RESET)
Net-(H11-9): H11.9 U18.9(DTRDI8)
Net-(H12-1): H12.1 U18.20(VDD_Ext)
Net-(H12-2): H12.2 U18.19(RES_H)
Net-(H12-3): H12.3 R6.1 R8.2 R26.2 U18.18(AD2DIO2)
Net-(H12-4): H12.4 U18.17(AD3DIO3)
Net-(H12-6): H12.6 U18.15(ASCAD5DIO5)
Net-(H12-7): H12.7 U18.14(VREF)
Net-(H12-8): H12.8 U18.13(ONSLEEP)
Net-(H13-1): H13.1 U15.7(CS)
Net-(H13-2): H13.2 U15.8(DI)
Net-(H13-3): H13.3 U15.9(RST)
Net-(H13-4): H13.4 U15.10(P1)
Net-(H13-5): H13.5 JP3.2 U15.11(P0)
Net-(H13-6): H13.6 U15.12(BT)
Net-(H14-2): H14.2 U15.2(3v3)
Net-(H14-6): H14.6 U15.6(INT)
Net-(H16-1): H16.1 U24.20(VDD_Ext)
Net-(H16-2): H16.2 U24.19(RES_H)
Net-(H16-3): H16.3 U24.18(AD2DIO2)
Net-(H16-4): H16.4 U24.17(AD3DIO3)
Net-(H16-5): H16.5 U24.16(RTSAD6DIO6)
Net-(H16-6): H16.6 U24.15(ASCAD5DIO5)
Net-(H16-7): H16.7 U24.14(VREF)
Net-(H16-8): H16.8 U24.13(ONSLEEP)
Net-(H16-9): H16.9 U24.12(CTSDIO7)
Net-(H16-10): H16.10 U24.11(EN)
Net-(H17-3): H17.3 U24.3(RX)
Net-(H17-4): H17.4 U24.4(DO8)
Net-(H17-5): H17.5 U24.5(RESET)
Net-(H17-6): H17.6 U24.6(PWM0RSSI)
Net-(H17-7): H17.7 U24.7(PWM1)
Net-(H17-8): H17.8 U24.8(RESERVED)
Net-(H17-9): H17.9 U24.9(DTRDI8)
Net-(H18-2): H18.2 JP4.1
Net-(H21-1): H21.1 U14.6(VDD)
Net-(H22-1): H22.1 R43.1
Net-(J4-1): J4.1 R62.2 SJ3.1
Net-(J4-3): J4.3 R71.2 SJ3.3
Net-(JP2-1): JP2.1 R64.1
Net-(LED1-1): LED1.1(A) LED15.2(A) R19.1 R31.1
Net-(LED2-1): LED2.1(A) LED16.2(A) R8.1 R26.1
Net-(LED3-2): LED3.2(K) R54.2
Net-(LED4-1): LED4.1(A) R61.1
Net-(LED5-2): LED5.2(K) R6.2
Net-(LED7-2): LED7.2(K) R17.2
Net-(LED8-2): LED8.2(K) R10.2
Net-(LED9-2): LED9.2(A) R27.1
Net-(LED10-2): LED10.2(A) R28.1
Net-(LED11-2): LED11.2(A) R51.1
Net-(LED12-1): LED12.1(C) Q9.2(C) SPEEDPULSEOPTO.2(CAT)
Net-(LED12-2): LED12.2(A) R23.2
Net-(LED17-1): LED17.1(K) R18.1
Net-(LED_REMOTE-1): LED_REMOTE.1(A) R20.1
Net-(LED_STEER-1): LED_STEER.1(A) R53.1
Net-(LED_WORK-1): LED_WORK.1(A) R52.1
Net-(P4-5): P4.5(ADDR) U16.5
Net-(P4-6): P4.6(ALRT) U16.6
Net-(P4-9): P4.9(A2) U16.9
Net-(P4-10): P4.10(A3) U16.10
Net-(PWR/ETH-1): PWR/ETH.1(+) R30.1 R33.2
Net-(PWR/ETH-3): PWR/ETH.3(+) R29.1 R32.2
Net-(Q2-1): Q2.1(C) Q3.2(C) Q8.1(G) R14.1 R47.1
Net-(Q2-2): Q2.2(B) Q3.1(B) R15.2 R25.2
Net-(Q9-1): Q9.1(B) R21.1
Net-(R1-1): R1.1 STEEROPTO.1(AN)
Net-(R3-1): R3.1 REMOTEOPTO.1(AN)
Net-(R16-1): R16.1 WORKOPTO.1(AN)
Net-(R24-1): R24.1 R42.1 RJ1.9
Net-(R43-2): R43.2 U14.7(OUT A#)
Net-(R48-2): R48.2 SPEEDPULSEOPTO.1(AN)
Net-(R60-1): R60.1 R66.2
Net-(R60-2): R60.2 R65.1 SPEEDPULSEOPTO.4(COL)

Not connected (* = marked no-connect by the designer): H20 2*; J2 19* MH1* MH2*; RJ1 7(NC)*; U4 1(ADDR)* 2(ALERT/RDY)* 6(AIN2)* 7(AIN3)*; U13 1*; U14 1(NC)* 4(IN B)* 5(OUT B#)* 8(NC)*; U25 4* 5* 14*; U26 2* 4*; U28 2* 3* 17*; U29 2* 3* 17*; U30 14* 22* 24*; USB2 4(ID)*; USB3 4(ID)*

## Notes on the sheet
- * Matt
  1mA for the SMT LEDs is plenty bright IMO
   - hard to see silkscreen with the LEDs so bright
  v4.0 input optos' blue LEDs used 2k (~0.25mA)
   - was maybe a little dim but still clearly evident
   - 1k for v4.1
  v4.0 vReg green LEDs used 510/2k for 3.3/5V (~1mA)
   - plenty bright, could be twice the resistance
   - used 1k/5.1k (already on pcb elsewhere) for v4.1
- THC remplacement
- MOTOR/VALVE CONTROL
- PWM2
- THC option
- THC option
- 5V USB
- Left
- Right
- PRESSURE/CURRENT CIRCUIT
- Power Input/Converters
- Engage 6/2
- Input Switches
- only for
- the holes
- Speedpulse Out
- WAS Circuit
- for ADS - MCP6002 Teensy A/D board
- 3.3V
- CANBUS
- BNO RX5
- BNO SDA
- IMU
- 3.3V
- CANBUS
